# Altium schematic sheet Bridge_H.SchDoc
size A3
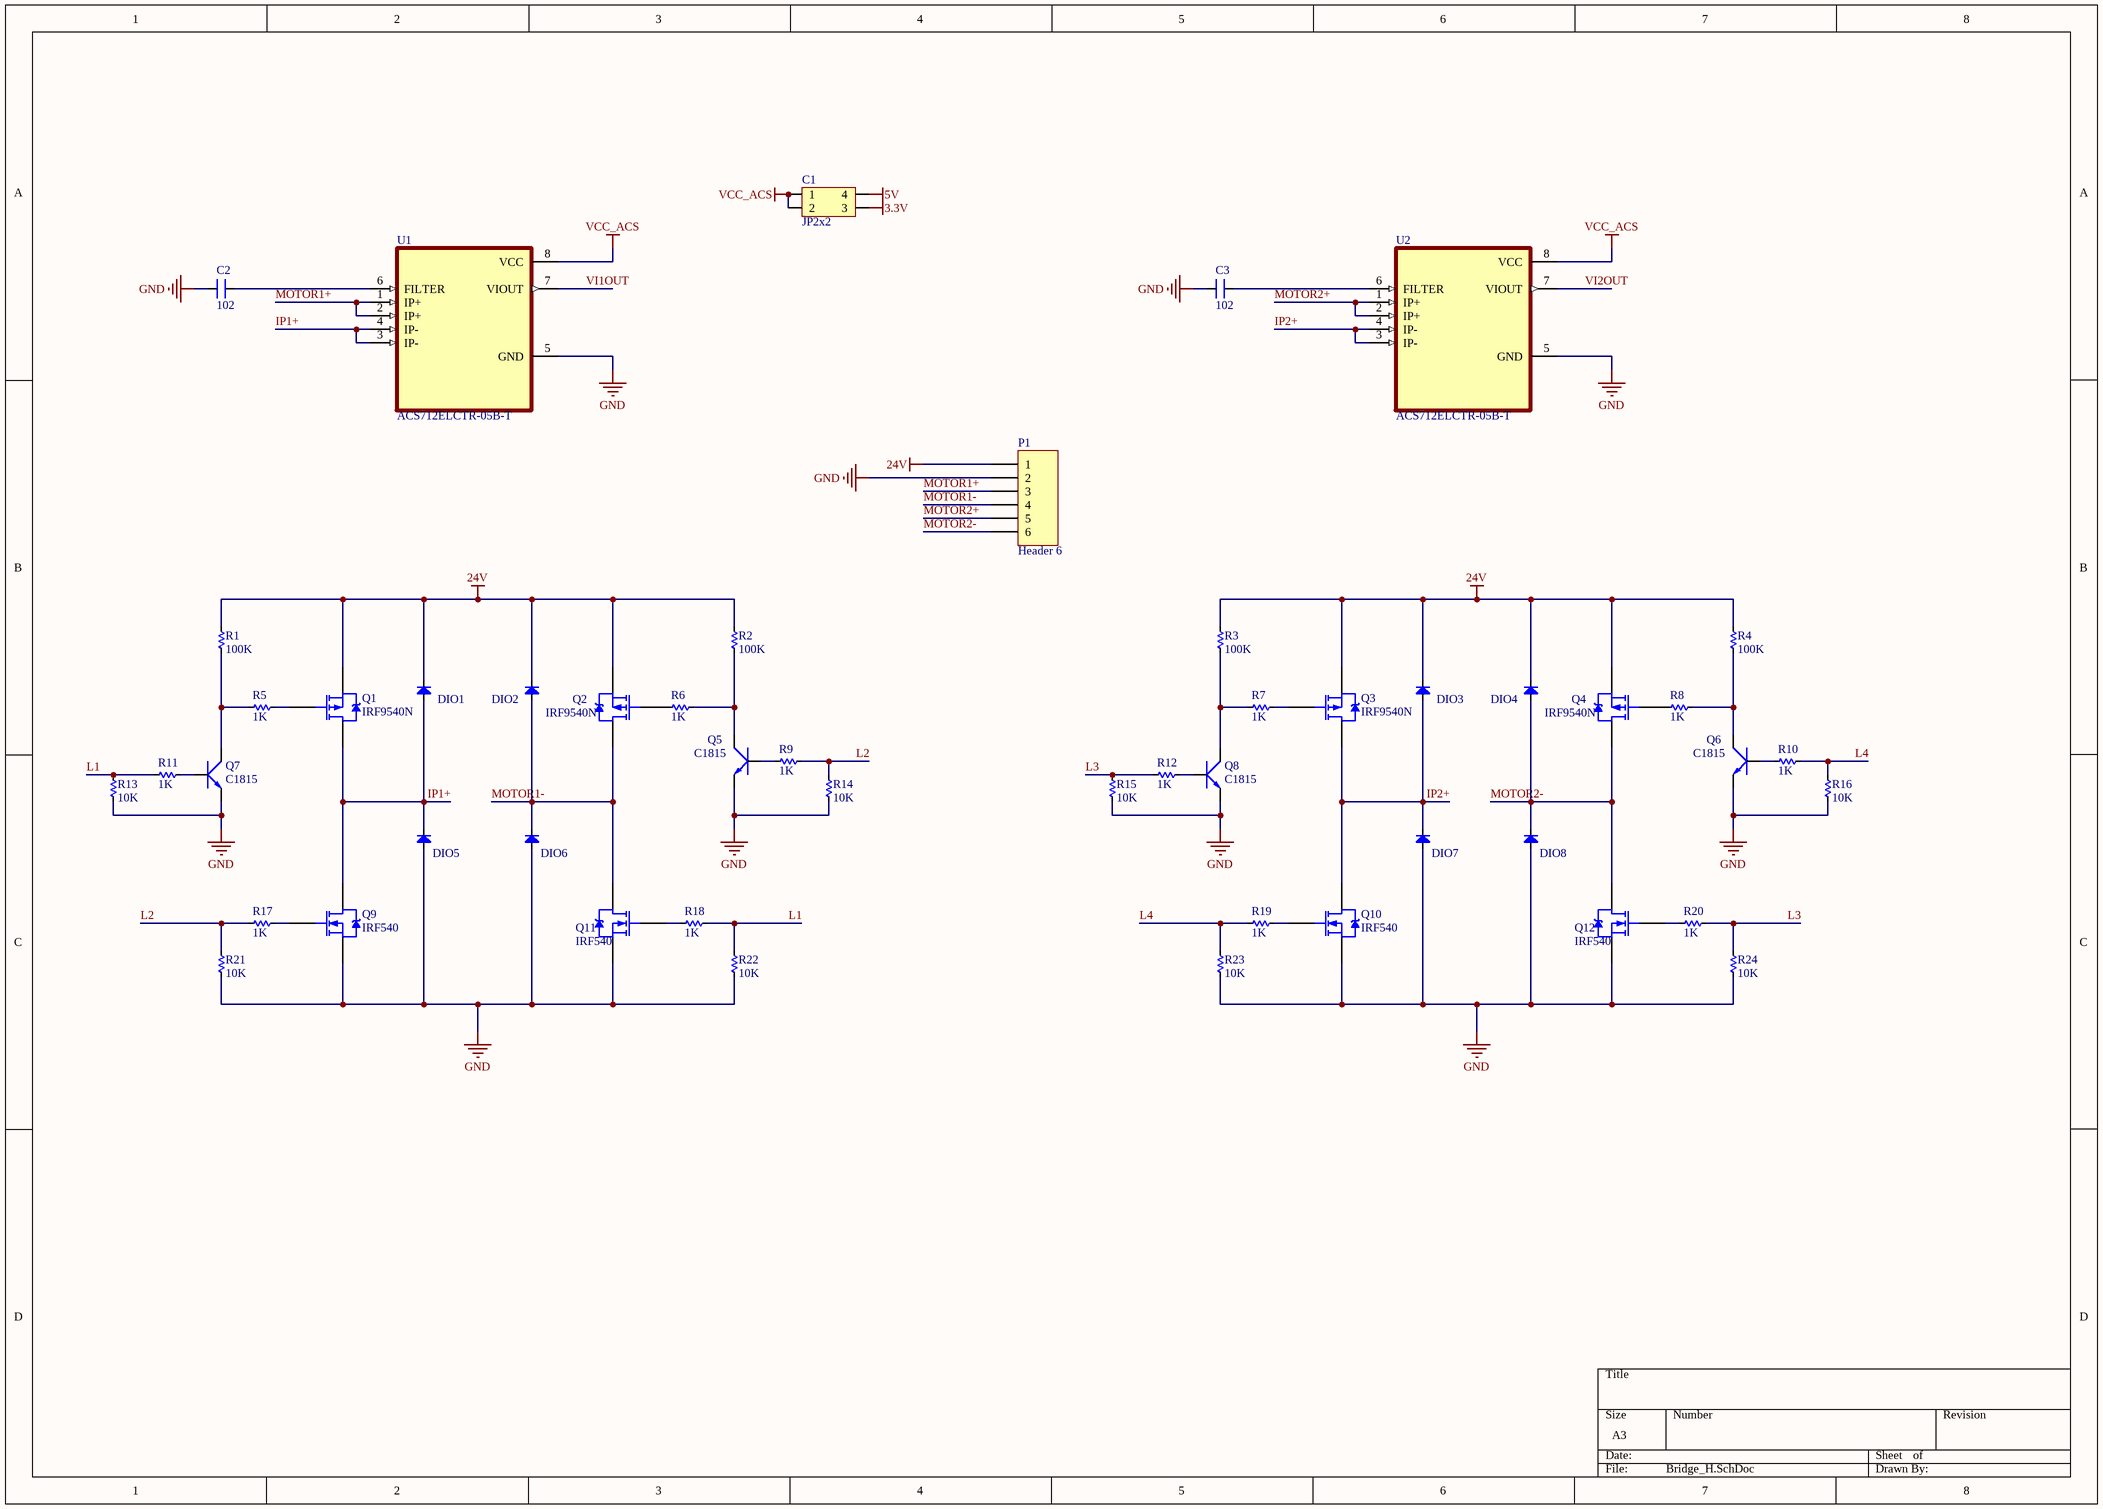
[diagram p0: Bridge_H.SchDoc]

## Parts
C1  JP2x2  [JP2-D2T]
C2  102  [SM-CAP-0805]
C3  102  [SM-CAP-0805]
DIO1  Diode SMD  [DIO-SMD-106]  (value not drawn)
DIO2  Diode SMD  [DIO-SMD-106]  (value not drawn)
DIO3  Diode SMD  [DIO-SMD-106]  (value not drawn)
DIO4  Diode SMD  [DIO-SMD-106]  (value not drawn)
DIO5  Diode SMD  [DIO-SMD-106]  (value not drawn)
DIO6  Diode SMD  [DIO-SMD-106]  (value not drawn)
DIO7  Diode SMD  [DIO-SMD-106]  (value not drawn)
DIO8  Diode SMD  [DIO-SMD-106]  (value not drawn)
P1  Header 6  [HED6T]
Q1  IRF9540N  [TO-220AB]
Q2  IRF9540N  [TO-220AB]
Q3  IRF9540N  [TO-220AB]
Q4  IRF9540N  [TO-220AB]
Q5  C1815  [SOT23B]
Q6  C1815  [SOT23B]
Q7  C1815  [SOT23B]
Q8  C1815  [SOT23B]
Q9  IRF540  [TO-220AB]
Q10  IRF540  [TO-220AB]
Q11  IRF540  [TO-220AB]
Q12  IRF540  [TO-220AB]
R1  100K  [RES-SMD-0805]
R2  100K  [RES-SMD-0805]
R3  100K  [RES-SMD-0805]
R4  100K  [RES-SMD-0805]
R5  1K  [RES-SMD-0805]
R6  1K  [RES-SMD-0805]
R7  1K  [RES-SMD-0805]
R8  1K  [RES-SMD-0805]
R9  1K  [RES-SMD-0805]
R10  1K  [RES-SMD-0805]
R11  1K  [RES-SMD-0805]
R12  1K  [RES-SMD-0805]
R13  10K  [RES-SMD-0805]
R14  10K  [RES-SMD-0805]
R15  10K  [RES-SMD-0805]
R16  10K  [RES-SMD-0805]
R17  1K  [RES-SMD-0805]
R18  1K  [RES-SMD-0805]
R19  1K  [RES-SMD-0805]
R20  1K  [RES-SMD-0805]
R21  10K  [RES-SMD-0805]
R22  10K  [RES-SMD-0805]
R23  10K  [RES-SMD-0805]
R24  10K  [RES-SMD-0805]
U1  ACS712ELCTR-05B-T  [SOIC127P600X175-8N]
U2  ACS712ELCTR-05B-T  [SOIC127P600X175-8N]

## Nets
3.3V: C1.3
5V: C1.4
24V: DIO1.2(K) DIO2.2(K) DIO3.2(K) DIO4.2(K) P1.1 Q1.3(S) Q2.3(S) Q3.3(S) Q4.3(S) R1.1 R2.1 R3.1 R4.1
GND: C2.1 C3.1 DIO5.1(A) DIO6.1(A) DIO7.1(A) DIO8.1(A) P1.2 Q5.1(E) Q6.1(E) Q7.1(E) Q8.1(E) Q9.3(S) Q10.3(S) Q11.3(S) Q12.3(S) R13.2 R14.2 R15.2 R16.2 R21.2 R22.2 R23.2 R24.2 U1.5(GND) U2.5(GND)
VCC_ACS: C1.1 C1.2 U1.8(VCC) U2.8(VCC)
IP1+: DIO1.1(A) DIO5.2(K) Q1.2(D) Q9.2(D) U1.3(IP-) U1.4(IP-)
IP2+: DIO3.1(A) DIO7.2(K) Q3.2(D) Q10.2(D) U2.3(IP-) U2.4(IP-)
L1: R11.2 R13.1 R18.1 R22.1
L2: R9.1 R14.1 R17.2 R21.1
L3: R12.2 R15.1 R20.1 R24.1
L4: R10.1 R16.1 R19.2 R23.1
MOTOR1+: P1.3 U1.1(IP+) U1.2(IP+)
MOTOR1-: DIO2.1(A) DIO6.2(K) P1.4 Q2.2(D) Q11.2(D)
MOTOR2+: P1.5 U2.1(IP+) U2.2(IP+)
MOTOR2-: DIO4.1(A) DIO8.2(K) P1.6 Q4.2(D) Q12.2(D)
VI1OUT: U1.7(VIOUT)
VI2OUT: U2.7(VIOUT)
NetC2_2: C2.2 U1.6(FILTER)
NetC3_2: C3.2 U2.6(FILTER)
NetQ1_1: Q1.1(G) R5.2
NetQ2_1: Q2.1(G) R6.1
NetQ3_1: Q3.1(G) R7.2
NetQ4_1: Q4.1(G) R8.1
NetQ5_2: Q5.2(C) R2.2 R6.2
NetQ5_3: Q5.3(B) R9.2
NetQ6_2: Q6.2(C) R4.2 R8.2
NetQ6_3: Q6.3(B) R10.2
NetQ7_2: Q7.2(C) R1.2 R5.1
NetQ7_3: Q7.3(B) R11.1
NetQ8_2: Q8.2(C) R3.2 R7.1
NetQ8_3: Q8.3(B) R12.1
NetQ9_1: Q9.1(G) R17.1
NetQ10_1: Q10.1(G) R19.1
NetQ11_1: Q11.1(G) R18.2
NetQ12_1: Q12.1(G) R20.2

## Library data of the parts
C1 = JP2x2: WR-PHD 2.54 mm Dual Socket Header; Manufacturer: W¨¹rth Elektronik eiSos GmbH; partNo: 61300421821; ComponentLink1 Description: Manufacturer; ComponentLink2 Description: Datasheet; NoPins: 04; Created Date: 29 March 2013; ComponentLink1URL: http://www.we-online.com; ComponentLink2URL: http://katalog.we-online.de/em/datasheet/6130xx21821.pdf; Created by: Karrer Zheng
C2 C3 = CN: Value: 0,1uF/300V; Designed by: VanDungEvn
DIO1-DIO8 = Diode SMD: Default Diode; Code - JEDEC: DO-214-AB; Value: 1N5007; Published: 8-Jun-2000; Revision: July-2002: Re-released for DXP Platform.; Publisher: Altium Limited
P1 = Header 6: Header, 6-Pin; LatestRevisionDate: 17-Jul-2002; LatestRevisionNote: Re-released for DXP Platform.; Publisher: Altium Limited
Q1-Q4 = IRF9540N: HEXFET Power MOSFET; Note: Pin 2 is electrically connected to pin 4.; Published: 8-Jun-2000; LatestRevisionDate: 17-Jul-2002; LatestRevisionNote: Re-released for DXP Platform.; DatasheetVersion: May-1998; PackageVersion: Feb-1997; PackageReference: TO-220AB; Publisher: Altium Limited; PackageDescription: TO, Thru-Hole, Vertical, Heatsink Mounted; 3 In-Line Leads; Pitch 2.54 mm; ComponentLink1Description: Manufacturer Link; ComponentLink1URL: http://www.irf.com/; ComponentLink2Description: Datasheet; ComponentLink2URL: http://www.irf.com/product-info/datasheets/data/irf9540n.pdf
Q5-Q8 = C1815: NPN 600mW, ECB; Value: C1815
Q9-Q12 = IRF540: HEXFET N-Channel Power MOSFET; Note: Pin 2 is electrically connected to pin 4.; Published: 8-Jun-2000; LatestRevisionDate: 17-Jul-2002; LatestRevisionNote: Re-released for DXP Platform.; DatasheetVersion: PD-9.373H; PackageVersion: Feb-1997; PackageReference: TO-220AB; Publisher: Altium Limited; PackageDescription: TO, Thru-Hole, Vertical, Heatsink Mounted; 3 In-Line Leads; Pitch 2.54 mm; ComponentLink1Description: Manufacturer Link; ComponentLink1URL: http://www.irf.com/
R1-R24 = Res-SMD: Resistor; Manufacturer: Generic Components; Class: Passive; Published: 08/06/2000; Publisher: Altium Hobart Technology Centre
U1 U2 = ACS712ELCTR-05B-T: Current Sensor 5A 1 Channel Hall Effect, Open Loop Bidirectional 8-SOIC _0.154, 3.90mm Width_; MF: Allegro MicroSystems LLC; MP: ACS712ELCTR-05B-T; Digi-Key_Part_Number: 620-1189-1-ND; Package: SOIC-8 Allegro MicroSystems LLC; Digi-Key_Purchase_URL: https://www.digikey.in/product-detail/en/allegro-microsystems/ACS712ELCTR-05B-T/620-1189-1-ND/1284606?utm_source=snapeda&utm_medium=aggregator&utm_campaign=symbol; Value: *; SnapEDA_Link: https://www.snapeda.com/parts/ACS712ELCTR-05B-T/Allegro%20MicroSystems%20LLC/view-part/46765/?ref=snap